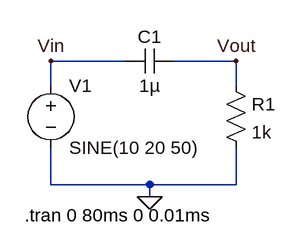
[diagram p0: schematic main.asc]
main.asc, the LTspice schematic file:
Version 4
SHEET 1 880 680
WIRE -96 48 -192 48
WIRE 48 48 -32 48
WIRE -192 80 -192 48
WIRE 48 80 48 48
WIRE -192 208 -192 160
WIRE -64 208 -192 208
WIRE 48 208 48 160
WIRE 48 208 -64 208
WIRE -64 224 -64 208
FLAG -64 224 0
FLAG -192 48 Vin
FLAG 48 48 Vout
SYMBOL res 32 64 R0
SYMATTR InstName R1
SYMATTR Value 1k
SYMBOL cap -32 32 R90
WINDOW 0 0 32 VBottom 2
WINDOW 3 32 32 VTop 2
SYMATTR InstName C1
SYMATTR Value 1µ
SYMBOL voltage -192 64 R0
WINDOW 123 0 0 Left 0
WINDOW 39 0 0 Left 0
SYMATTR InstName V1
SYMATTR Value SINE(10 20 50)
TEXT -226 248 Left 2 !.tran 0 80ms 0 0.01ms

The netlist it stands for:
* main.asc
R1 Vout 0 1k
C1 Vout Vin 1µ
V1 Vin 0 SINE(10 20 50)
.tran 0 80ms 0 0.01ms
.backanno
.end

* Results of the author's LTspice run, read from the files saved beside the schematic
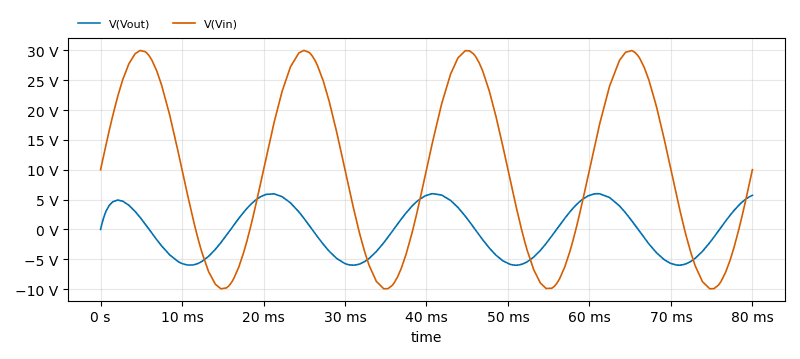
[diagram p1: Transient Analysis of main.asc, plotted from the saved traces]
* Transient Analysis, 1 run:
*   V(Vout): min -5.994 V, max 5.993 V, average -73.82 mV, rms 4.161 V, last 5.719 V
*   V(Vin): min -9.949 V, max 30 V, average 9.987 V, rms 17.31 V, last 10 V